# EAGLE design rgbww32c3wroom02-DCDC (EAGLE 7.7.0)
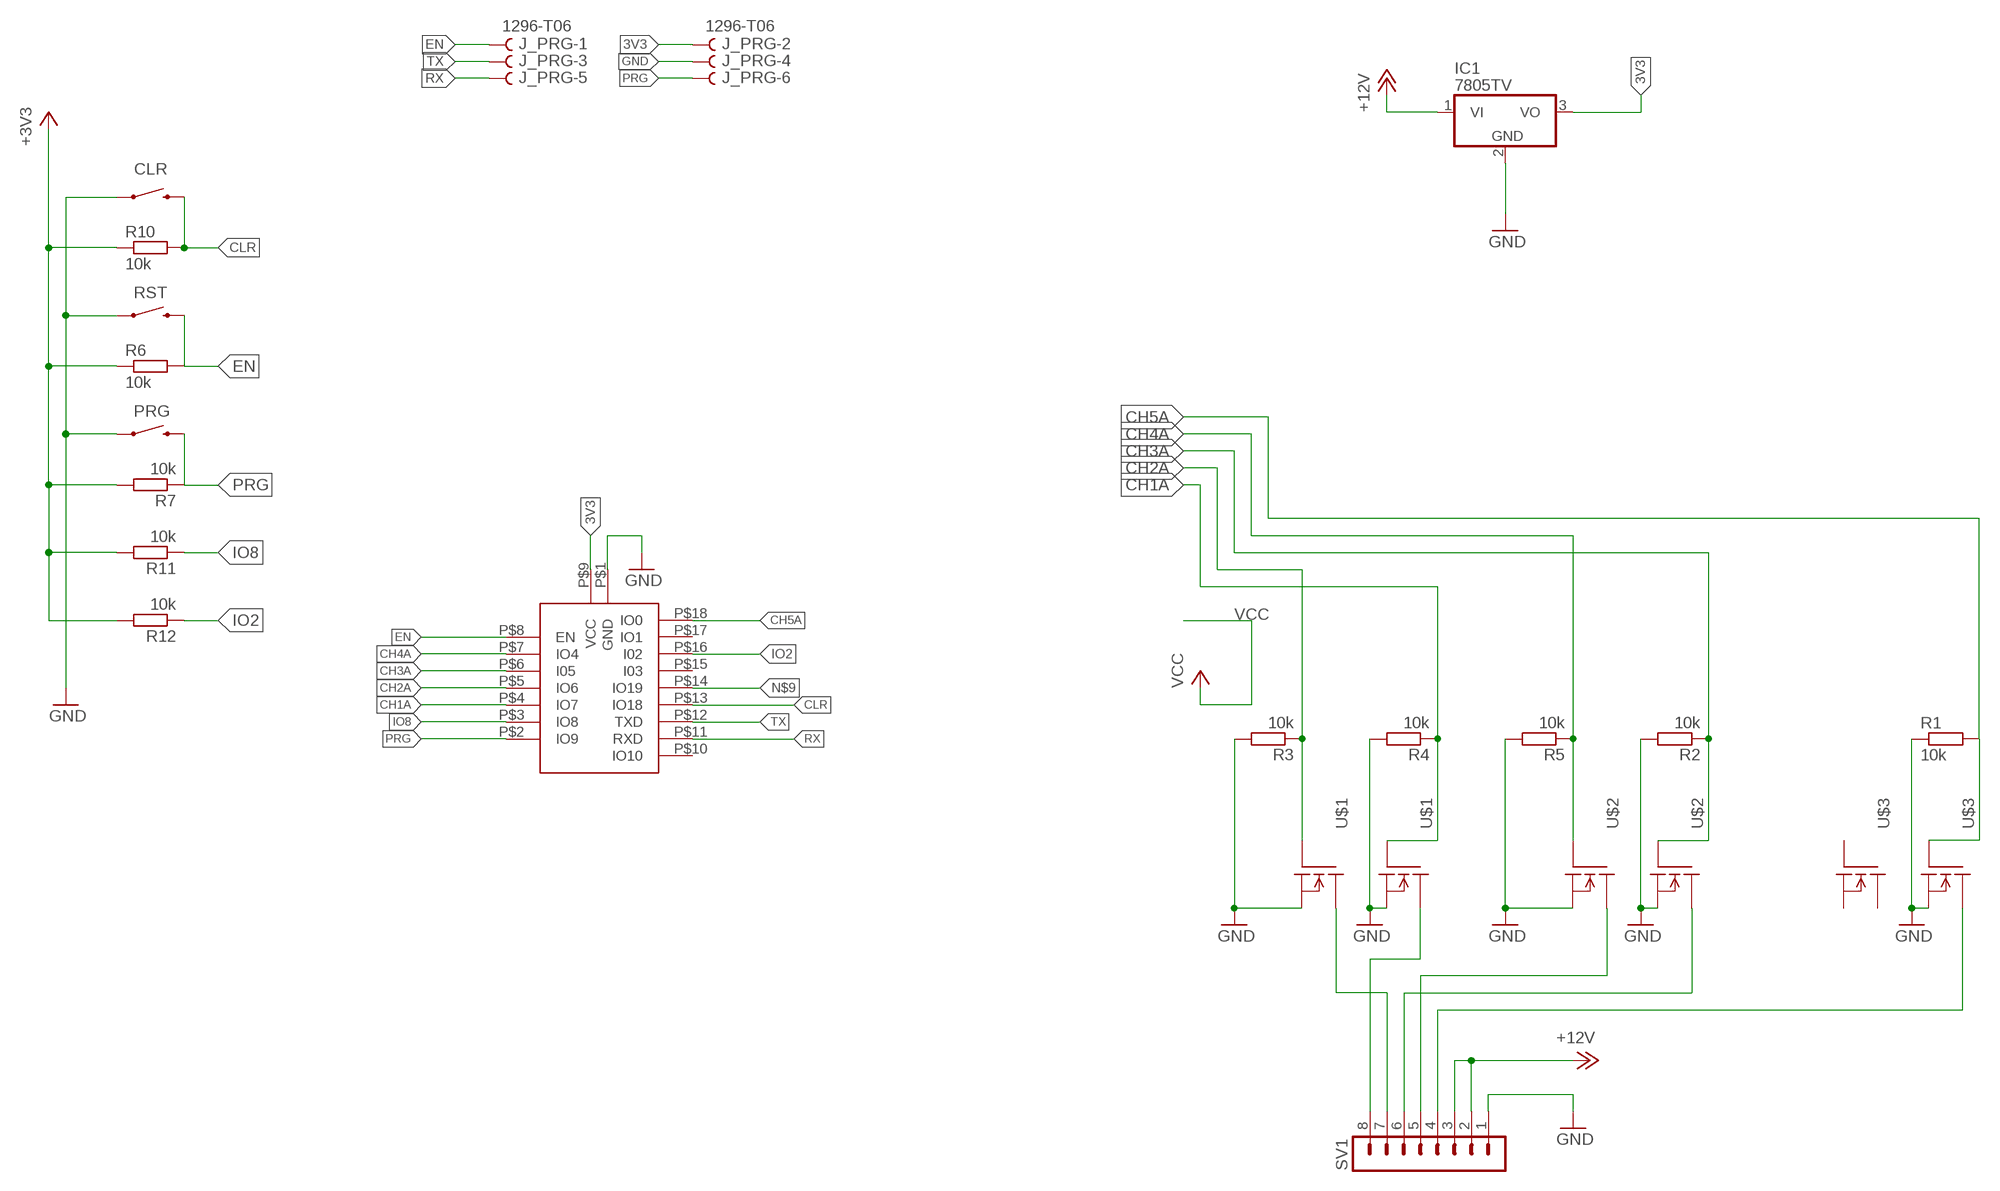
[diagram p0: schematic, sheet 1]

## Parts
CLR  SWITCH-MOMENTARY-2SMD-1101NE  [TACTILE-SWITCH-1101NE]
IC1  7805TV  [TO220V]
J_PRG  1296-T06  [06]
PRG  SWITCH-MOMENTARY-2SMD-1101NE  [TACTILE-SWITCH-1101NE]
R1  10k  R-EU_R0805  [R0805]
R2  10k  R-EU_R0805  [R0805]
R3  10k  R-EU_R0805  [R0805]
R4  10k  R-EU_R0805  [R0805]
R5  10k  R-EU_R0805  [R0805]
R6  10k  R-EU_R0805  [R0805]
R7  10k  R-EU_R0805  [R0805]
R10  10k  R-EU_R0805  [R0805]
R11  10k  R-EU_R0805  [R0805]
R12  10k  R-EU_R0805  [R0805]
RST  SWITCH-MOMENTARY-2SMD-1101NE  [TACTILE-SWITCH-1101NE]
SV1  MA08-1  [MA08-1]
U$1  AOD4806  [SO08]
U$2  AOD4806  [SO08]
U$3  AOD4806  [SO08]
U$5  ESP32C3WROOM02  [SMD]

## Nets
3V3: IC1.3(VO) J_PRG.2 R6.1 R7.2 R10.1 R11.2 R12.2 U$5.P$9(VCC) ; supply symbol labelled +3V3
12V: IC1.1(VI) SV1.2 SV1.3 ; supply symbol labelled +12V
CH1: SV1.8 U$1.5(D) U$1.6(D)
CH1A: R4.1 U$1.4(G) U$5.P$4(IO7)
CH2: SV1.7 U$1.7(D1) U$1.8(D1)
CH2A: R3.1 U$1.2(G1) U$5.P$5(IO6)
CH3: SV1.6 U$2.5(D) U$2.6(D)
CH3A: R2.1 U$2.4(G) U$5.P$6(I05)
CH4: SV1.5 U$2.7(D1) U$2.8(D1)
CH4A: R5.1 U$2.2(G1) U$5.P$7(IO4)
CH5: SV1.4 U$3.5(D) U$3.6(D)
CH5A: R1.2 U$3.4(G) U$5.P$18(IO0)
CLR: CLR.2 R10.2 U$5.P$13(IO18)
EN [Signal]: J_PRG.1 R6.2 RST.2 U$5.P$8(EN)
GND: CLR.1 IC1.2(GND) J_PRG.4 PRG.1 R1.1 R2.2 R3.2 R4.2 R5.2 RST.1 SV1.1 U$1.1(S1) U$1.3(S) U$2.1(S1) U$2.3(S) U$3.3(S) U$5.P$1(GND)
IO2: R12.1 U$5.P$16(I02)
IO8: R11.1 U$5.P$3(IO8)
N$9: U$5.P$14(IO19)
PRG: J_PRG.6 PRG.2 R7.1 U$5.P$2(IO9)
RX: J_PRG.5 U$5.P$11(RXD)
TX: J_PRG.3 U$5.P$12(TXD)
Unconnected: U$3.1(S1) U$3.2(G1) U$3.7(D1) U$3.8(D1) U$5.P$10(IO10) U$5.P$15(I03) U$5.P$17(IO1)

## Library data of the parts
CLR PRG RST = SparkFun-Electromechanical:SWITCH-MOMENTARY-2: Various NO switches- pushbuttons, reed, etc; PROD_ID: SWCH-00815
IC1 = linear:78*: Positive VOLTAGE REGULATOR Source: http://cache.national.com/ds/LM/LM78L05.pdf http://www.fairchildsemi.com/ds/LM/LM7805.pdf
J_PRG = con-leotronics:1296-T06: 1.27mm SINGLE ROW FEMALE SOCKET Source: http://www.leotronics.co.uk/Conexcon/Data%20Sheets/sec.%20A/1296ing.pdf
R1-R7 R10-R12 = rcl:R-EU_: RESISTOR, European symbol
SV1 = con-lstb:MA08-1: PIN HEADER; OC_FARNELL: unknown; OC_NEWARK: unknown
U$1-U$3 = esp12_RGBWW:AOD4806
U$5 = ESP32C3M:ESP32C3WROOM02: ESP32C3WROOM02 Module

## Net classes
5 Signal: width 0.381 mm

## Board
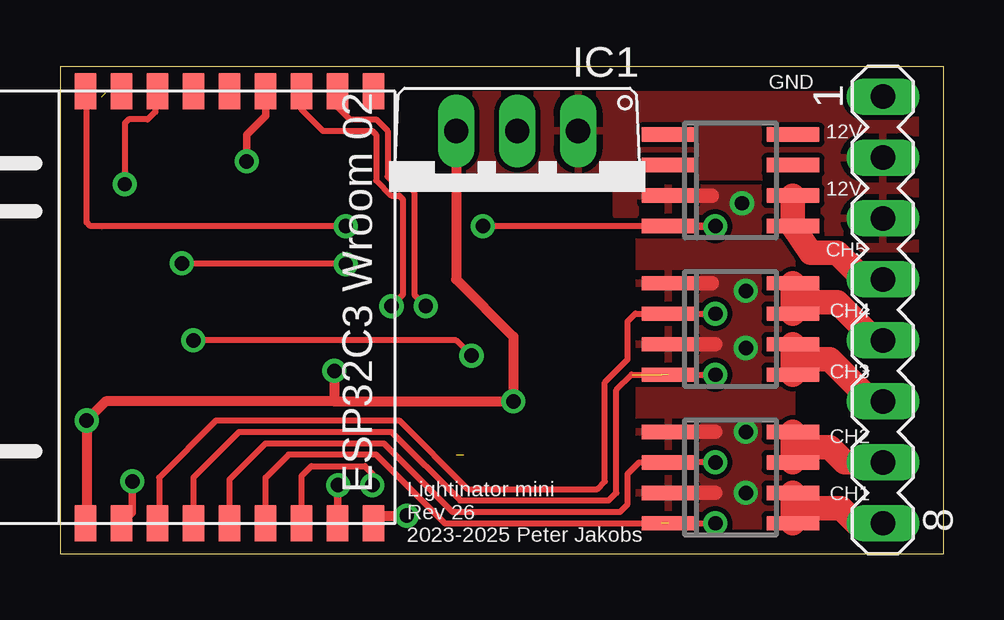
[diagram p1: board, top side]
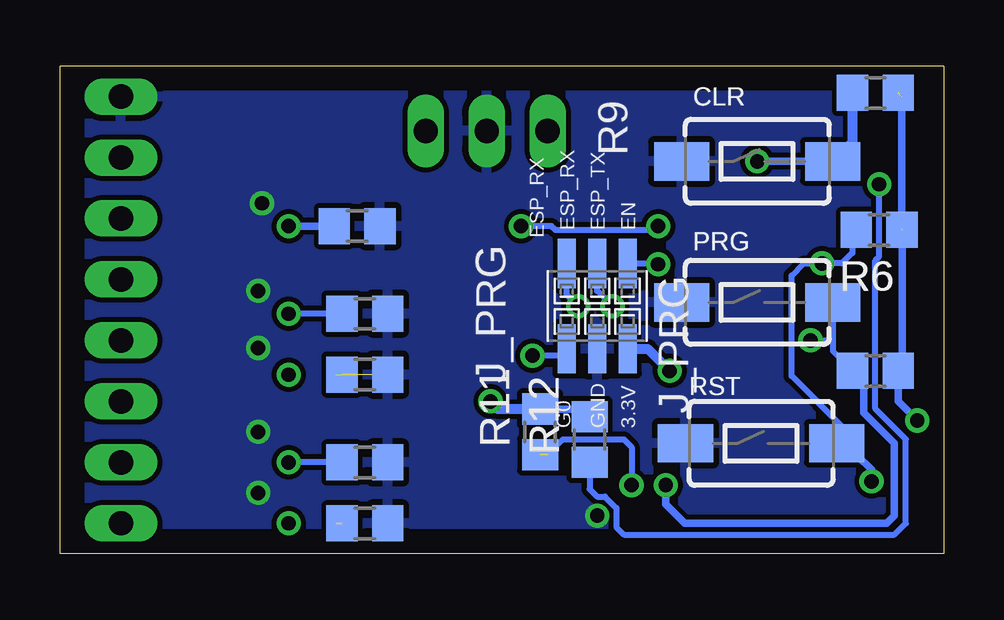
[diagram p2: board, bottom side, seen from below]

Size 36.83 x 20.32 mm. Coordinates in mm from the lower left corner, seen from the top.
Outline: 36.82,20.31 36.82,0 0,0 0,20.31
Outline: 0.01,20.32 36.83,20.32
Copper layers (1*16): Top 0.035mm / dielectric 1.5mm / Bottom 0.035mm
Design rules "default": minimum track width 10mil, minimum drill 24mil, track to track 8mil, track to pad 8mil, pad to pad 8mil, via to via 8mil, smd to smd 8mil, copper to edge 40mil, drill to drill 8mil, minimum pad ring 10mil, minimum via ring 8mil, stop-mask expansion 4mil, vias tented up to drill 0mil, thermal gap 10mil

### Footprints (pad centres in the part's own frame; a part is rotated, then mirrored left to right if it is on the bottom)
TACTILE-SWITCH-1101NE = smd 2.3 x 1.6: 1 -3.15,0; 2 3.15,0
TO220V = drill 1.016 long: 1 -2.54,-2.54; 2 0,-2.54; 3 2.54,-2.54
06 = smd 0.76 x 2.05: 1 -1.27,-1.78; 2 -1.27,1.78; 3 0,-1.78; 4 0,1.78; 5 1.27,-1.78; 6 1.27,1.78
R0805 = smd 1.3 x 1.5: 1 -0.95,0; 2 0.95,0
MA08-1 = drill 1.016 long: 1 -8.89,0; 2 -6.35,0; 3 -3.81,0; 4 -1.27,0; 5 1.27,0; 6 3.81,0; 7 6.35,0; 8 8.89,0
SO08 = smd 0.6 x 2.2: 1 -1.905,-2.6; 2 -0.635,-2.6; 3 0.635,-2.6; 4 1.905,-2.6; 5 1.905,2.6; 6 0.635,2.6; 7 -0.635,2.6; 8 -1.905,2.6
SMD = smd 1.5 x 0.9: P$1 -8.89,-6.4; P$2 -8.89,-4.9; P$3 -8.89,-3.4; P$4 -8.89,-1.9; P$5 -8.89,-0.4; P$6 -8.89,1.1; P$7 -8.89,2.6; P$8 -8.89,4.1; P$9 -8.89,5.6; P$10 9.11,-6.4; P$11 9.11,-4.9; P$12 9.11,-3.4; P$13 9.11,-1.9; P$14 9.11,-0.4; P$15 9.11,1.1; P$16 9.11,2.6; P$17 9.11,4.1; P$18 9.11,5.6

### Placement (x,y rotation side)
CLR  7.78,16.35 0 bottom
IC1  19.05,15.08 180 top
J_PRG  14.45,10.32 180 bottom
PRG  7.78,10.48 0 bottom
R1  24.45,13.65 180 bottom
R2  24.13,7.46 0 bottom
R3  24.13,3.81 0 bottom
R4  24.13,1.27 0 bottom
R5  24.13,10 0 bottom
R6  2.7,13.49 180 bottom
R7  2.86,7.62 0 bottom
R10  2.86,19.21 180 bottom
R11  16.83,5.08 90 bottom
R12  14.76,4.76 90 bottom
RST  7.62,4.6 0 bottom
SV1  34.29,10.16 270 top
U$1  27.94,3.18 270 top
U$2  27.94,9.37 270 top
U$3  27.94,15.56 270 top
U$5  6.67,10.16 90 top

### Tracks (layer width: path | path; a pad name or v marks a point on that pad's centre or on a via)
3V3  (via drill 0.6)  (2 unrouted)
  Top 0.406: 11.43,6.35 1.91,6.35 v1.11,5.56 1.11,1.31 U$5.P$9 | v11.43,7.62 11.43,6.35 | 11.43,6.35 v18.89,6.35 18.89,9.05 16.51,11.43 IC1.3
  Bottom 0.305: R6.1 1.75,19.05 | R6.1 1.75,7.78 R7.2 1.91,6.35 v1.11,5.56 | R11.2 15.08,6.03 R12.2
  Bottom 0.406: J_PRG.2 12.35,8.54 v11.43,7.62 | R11.2 18.57,6.03 v18.89,6.35
12V
  pour Top: 13.97,20.32 36.83,20.32 36.83,12.7 31.75,12.7 31.91,15.72 23.97,15.72 23.97,14.13 23.18,14.13 23.18,15.24 13.97,15.24
CH1
  Top 1.016: U$1.5 30.54,1.91 | 30.54,1.91 U$1.6 | SV1.8 33.18,1.27 32.54,1.91 30.54,1.91
CH1A  (via drill 0.6)  (1 unrouted)
  Top 0.254: U$5.P$4 8.57,3.17 9.53,4.13 13.18,4.13 16.03,1.27 U$1.4 | 25.4,1.27 U$1.4 | U$1.4 v27.3,1.27
CH2
  Top 1.016: U$1.7 30.54,4.45 | 30.54,4.45 U$1.8 | SV1.7 32.7,3.81 32.07,4.45 30.54,4.45
CH2A  (via drill 0.6)
  Top 0.254: v27.3,3.81 U$1.2 24.13,3.81 23.65,3.33 23.65,2.06 23.34,1.75 16.35,1.75 13.49,4.6 8.57,4.6 7.07,3.1 U$5.P$5
  Bottom 0.254: R3.1 v27.3,3.81
CH3
  Top 1.016: U$2.6 U$2.5 31.18,8.1 32.07,8.1 33.81,6.35 SV1.6
CH3A  (via drill 0.6)  (2 unrouted)
  Top 0.254: U$5.P$6 5.57,3.19 7.46,5.08 13.81,5.08 16.67,2.22 22.86,2.22 23.18,2.54 23.18,6.83 23.81,7.46 v27.3,7.46
CH4
  Top 1.016: U$2.8 U$2.7 31.02,10.48 32.38,10.48 33.97,8.89 SV1.5
CH4A  (via drill 0.6)
  Top 0.254: v27.3,10 U$2.2 23.97,10 23.65,9.68 23.65,8.1 22.7,7.14 22.7,3.02 22.38,2.7 16.99,2.7 14.13,5.56 6.51,5.56 4.13,3.18 4.13,1.33
  Top 0.305: 4.13,1.33 U$5.P$7
  Bottom 0.254: R5.1 v27.3,10
CH5
  Top 1.016: U$3.6 U$3.5 31.27,12.54 32.38,12.54 33.5,11.43 SV1.4
CH5A  (via drill 0.6)
  Top 0.254: v11.91,13.65 1.27,13.65 1.11,13.81 1.11,19.23 U$5.P$18 | U$3.4 v17.62,13.65
  Top 0.305: U$3.4 v27.3,13.65
  Bottom 0.254: v11.91,13.65 12.06,13.49 16.19,13.49 16.35,13.65 v17.62,13.65
  Bottom 0.305: R1.2 v27.3,13.65
CLR  (via drill 0.6)
  Top 0.305: U$5.P$13 8.57,18.25 7.78,17.46 v7.78,16.35
  Bottom 0.305: CLR.2 v7.78,16.35
  Bottom 0.406: CLR.2 3.81,17.17 R10.2
EN  (via drill 0.6)
  Top 0.254: v5.08,12.1 11.87,12.1 v11.91,12.06
  Top 0.305: U$5.P$8 3.02,1.72 v3.02,3.02
  Bottom 0.254: J_PRG.1 11.94,12.1 v11.91,12.06 | 3.81,13.33 3.81,12.54 4.25,12.1 v5.08,12.1 5.84,12.1 6.35,11.59 6.35,7.41 4.15,5.21
  Bottom 0.305: 3.81,13.33 R6.2 | 4.45,4.13 3.65,4.13 3.02,3.49 v3.02,3.02 | 4.45,5.21 4.15,5.21
  Bottom 0.406: 4.45,4.13 4.45,5.21 RST.2
GND  (via drill 0.6)
  Top 0.406: U$5.P$1 13.38,1.59 v14.45,1.59
  Top 0.61: 25.4,14.92 27.15,14.92 | 25.4,11.27 27.15,11.27 | 25.4,8.73 27.3,8.73 | 25.4,5.08 27.3,5.08 | 25.4,2.54 27.3,2.54
  other vias: 28.42,14.61 28.57,10.95 28.57,8.57 28.57,5.08 28.57,2.54
  pour Top: 24.13,0 24.13,15.24 30.48,15.24 30.48,0
  pour Bottom: 0,0 0,20.32 36.83,20.32 36.83,0
IO2  (via drill 0.6)
  Top 0.254: 3.97,19.17 3.97,18.42 3.65,18.1 2.86,18.1 2.7,17.94 v2.7,15.4
  Top 0.305: 3.97,19.17 U$5.P$16
  Bottom 0.254: R12.1 14.76,2.7 14.45,2.38 14.13,2.38 13.65,1.91 13.65,1.11 13.34,0.79 2.06,0.79 1.59,1.27 1.59,4.76 2.86,6.03 2.86,12.22 2.7,12.38 v2.7,15.4
IO8  (via drill 0.6)  (1 unrouted)
  Top 0.254: U$5.P$3 10.07,3.24 10.48,3.65 12.7,3.65 13.02,3.33 v13.02,2.86
  Bottom 0.254: 16.51,4.13 15.88,4.76 13.34,4.76 13.02,4.45 v13.02,2.86
PRG  (via drill 0.6)
  Top 0.254: v17.14,8.25 16.51,8.89 v5.56,8.89
  Top 0.305: v11.59,2.86 11.57,2.84 U$5.P$2
  Bottom 0.254: PRG.2 4.63,8.89 | 4.63,8.89 4.63,8.44 R7.1 | J_PRG.6 16,8.25 v17.14,8.25 | v5.56,8.89 4.63,8.89
  Bottom 0.305: R7.1 3.33,7.15 3.33,5.87 2.06,4.6 2.06,1.59 2.38,1.27 10.79,1.27 11.59,2.06 v11.59,2.86
RX  (via drill 0.6)
  Top 0.254: U$5.P$11 11.57,18.59 12.06,18.1 13.18,18.1 13.65,17.62 13.65,15.72 13.97,15.4 14.45,15.4 14.76,15.08 14.76,10.8 v15.24,10.32
  Bottom 0.254: v15.24,10.32 15.72,10.8 J_PRG.5
TX  (via drill 0.6)
  Top 0.254: U$5.P$12 10.07,18.51 10.95,17.62 13.02,17.62 13.18,17.46 13.18,15.56 13.81,14.92 14.13,14.92 14.29,14.76 14.29,10.8 v13.81,10.32
  Bottom 0.254: v13.81,10.32 14.45,10.95 J_PRG.3

### Text on the board
tNames: GND | 12V | 12V | CH5 | CH4 | CH3 | CH2 | CH1 | Lightinator mini / Rev 26 / 2023-2025 Peter Jakobs
bNames: EN | ESP_TX | ESP_RX | ESP_RX | 3.3V | GND | G0
_bNames: R9 | CLR | CLR | J_PRG | R6 | R6 | PRG | PRG | RST | RST | R12 | R12 | R11 | R11